# EAGLE schematic WaterbedSlave (EAGLE 7.4.0)
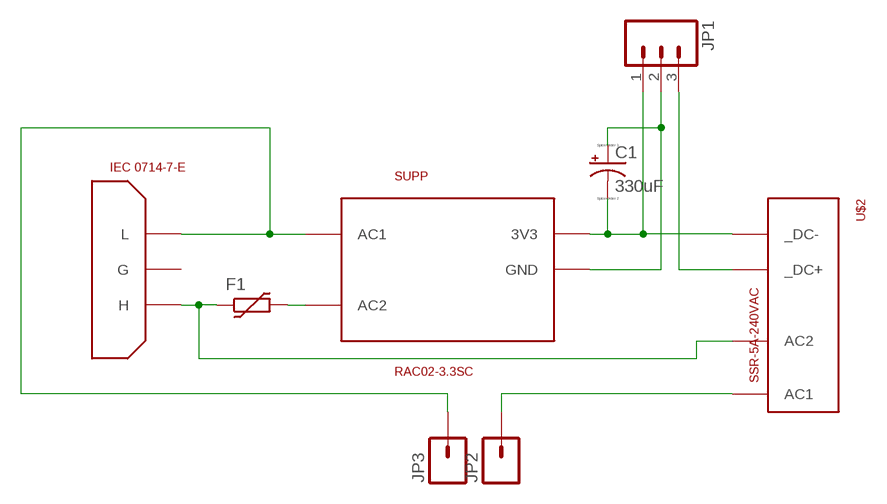
[diagram p0: schematic, sheet 1]

## Parts
C1  330uF  CPOL-USTT5D9  [TT5D9]
F1  FUSE_PTC-1812  [PTC1812L]
JP1  M03POLAR_LOCK  [MOLEX-1X3_LOCK]
JP2  M01PTH_2MM  [1X01_2MM]
JP3  M01PTH_2MM  [1X01_2MM]
SUPP  RAC02-3.3SC  [RAC02-3.3SC]
U$2  SSR-5A-240VAC  [SIP-4]
U$3  IEC 0714-7-E  IEC  [IEC]

## Nets
GND: C1.- JP1.1 SUPP.3V3 U$2.P$1(_DC-)
N$1: JP3.1 SUPP.AC1 U$3.L
N$6: JP2.1 U$2.P$4(AC1)
N$12: F1.2 SUPP.AC2
N$14: F1.1 U$2.P$3(AC2) U$3.H
N$15: C1.+ JP1.2 SUPP.GND
N$16: JP1.3 U$2.P$2(_DC+)
Unconnected: U$3.G

## Library data of the parts
C1 = resistor:CPOL-US: POLARIZED CAPACITOR, American symbol
F1 = dp_devices:FUSE_PTC: Resettable PTC
JP1 = SparkFun-Connectors:M03: Header 3 Standard 3-pin 0.1" header. Use with straight break away headers (SKU : PRT-00116), right angle break away headers (PRT-00553), swiss pins (PRT-00743), machine pins (PRT-00117), and female headers (PRT-00115). Molex polarized connector foot print use with SKU : PRT-08232 with associated crimp pins and housings.
JP2 JP3 = SparkFun-Connectors:M01: Header 1 Standard 1-pin 0.1" header. Use with straight break away headers (SKU : PRT-00116), right angle break away headers (PRT-00553), swiss pins (PRT-00743), machine pins (PRT-00117), and female headers (PRT-00115).
SUPP = CuriousTech:RAC02-3.3SC: RAC02-3.3SC
U$2 = CuriousTech:SSR-5A-240VAC
U$3 = CuriousTech:IEC: IEC Female